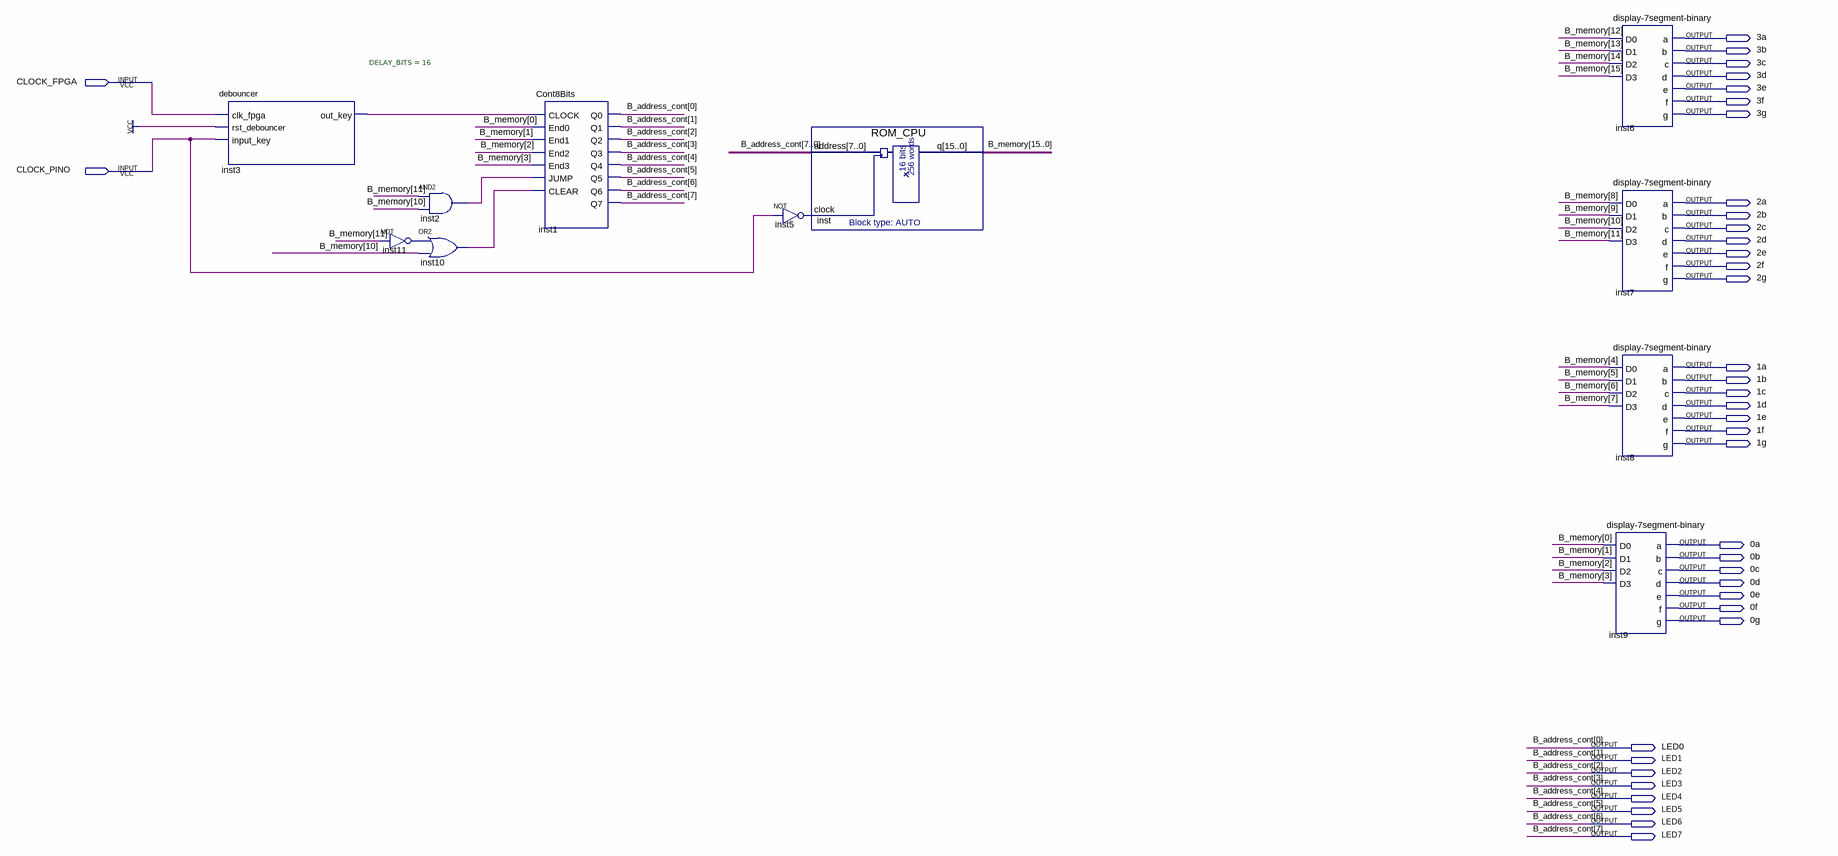
[diagram p0: schematic sheet]
// Quartus schematic CPU_FPGA.bdf as structural Verilog: 11 symbols, 38 pins
module CPU_FPGA (
  input  CLOCK_FPGA,
  input  CLOCK_PINO,
  output \3a ,
  output \3b ,
  output \3c ,
  output \3d ,
  output \3e ,
  output \3f ,
  output \3g ,
  output \2a ,
  output \2b ,
  output \2c ,
  output \2d ,
  output \2e ,
  output \2f ,
  output \2g ,
  output \1a ,
  output \1b ,
  output \1c ,
  output \1d ,
  output \1e ,
  output \1f ,
  output \1g ,
  output \0a ,
  output \0b ,
  output \0c ,
  output \0d ,
  output \0e ,
  output \0f ,
  output \0g ,
  output LED0,
  output LED1,
  output LED2,
  output LED3,
  output LED4,
  output LED5,
  output LED6,
  output LED7
);

  wire inst2_out, inst3_out_key, inst5_out, inst10_out, inst11_out;
  wire [15:0] B_memory;

  debouncer #(.DELAY_BITS(16)) inst3 (
    .clk_fpga(CLOCK_FPGA), .rst_debouncer(1'b1), .input_key(CLOCK_PINO), .out_key(inst3_out_key));
  not inst11 (inst11_out, B_memory[11]);
  and inst2 (inst2_out, B_memory[11], B_memory[10]);
  or inst10 (inst10_out, inst11_out, B_memory[10]);
  Cont8Bits inst1 (
    .CLOCK(inst3_out_key), .End0(B_memory[0]), .End1(B_memory[1]), .End2(B_memory[2]), .End3(B_memory[3]),
    .JUMP(inst2_out), .CLEAR(inst10_out), .Q0(LED0), .Q1(LED1), .Q2(LED2), .Q3(LED3), .Q4(LED4), .Q5(LED5),
    .Q6(LED6), .Q7(LED7));
  not inst5 (inst5_out, CLOCK_PINO);
  ROM_CPU inst (.address({LED7, LED6, LED5, LED4, LED3, LED2, LED1, LED0}), .clock(inst5_out), .q(B_memory));
  \display-7segment-binary  inst6 (
    .D0(B_memory[12]), .D1(B_memory[13]), .D2(B_memory[14]), .D3(B_memory[15]), .a(\3a ), .b(\3b ), .c(\3c ),
    .d(\3d ), .e(\3e ), .f(\3f ), .g(\3g ));
  \display-7segment-binary  inst7 (
    .D0(B_memory[8]), .D1(B_memory[9]), .D2(B_memory[10]), .D3(B_memory[11]), .a(\2a ), .b(\2b ), .c(\2c ),
    .d(\2d ), .e(\2e ), .f(\2f ), .g(\2g ));
  \display-7segment-binary  inst8 (
    .D0(B_memory[4]), .D1(B_memory[5]), .D2(B_memory[6]), .D3(B_memory[7]), .a(\1a ), .b(\1b ), .c(\1c ),
    .d(\1d ), .e(\1e ), .f(\1f ), .g(\1g ));
  \display-7segment-binary  inst9 (
    .D0(B_memory[0]), .D1(B_memory[1]), .D2(B_memory[2]), .D3(B_memory[3]), .a(\0a ), .b(\0b ), .c(\0c ),
    .d(\0d ), .e(\0e ), .f(\0f ), .g(\0g ));

  // Other names for the same wires on the sheet: B_address_cont[7:0] = {LED7, LED6, LED5, LED4, LED3, LED2, LED1, LED0}
endmodule
